# Altium schematic sheet ThirdStageAmplifier.SchDoc
size A4; Author: Michał Kowalik; CompanyName: AGH; Engineer: dr inż. Piotr Otfinowski; DocumentNumber: 4; Revision: Rev; SheetNumber: 4; SheetTotal: 6; ProjectName: Project Name
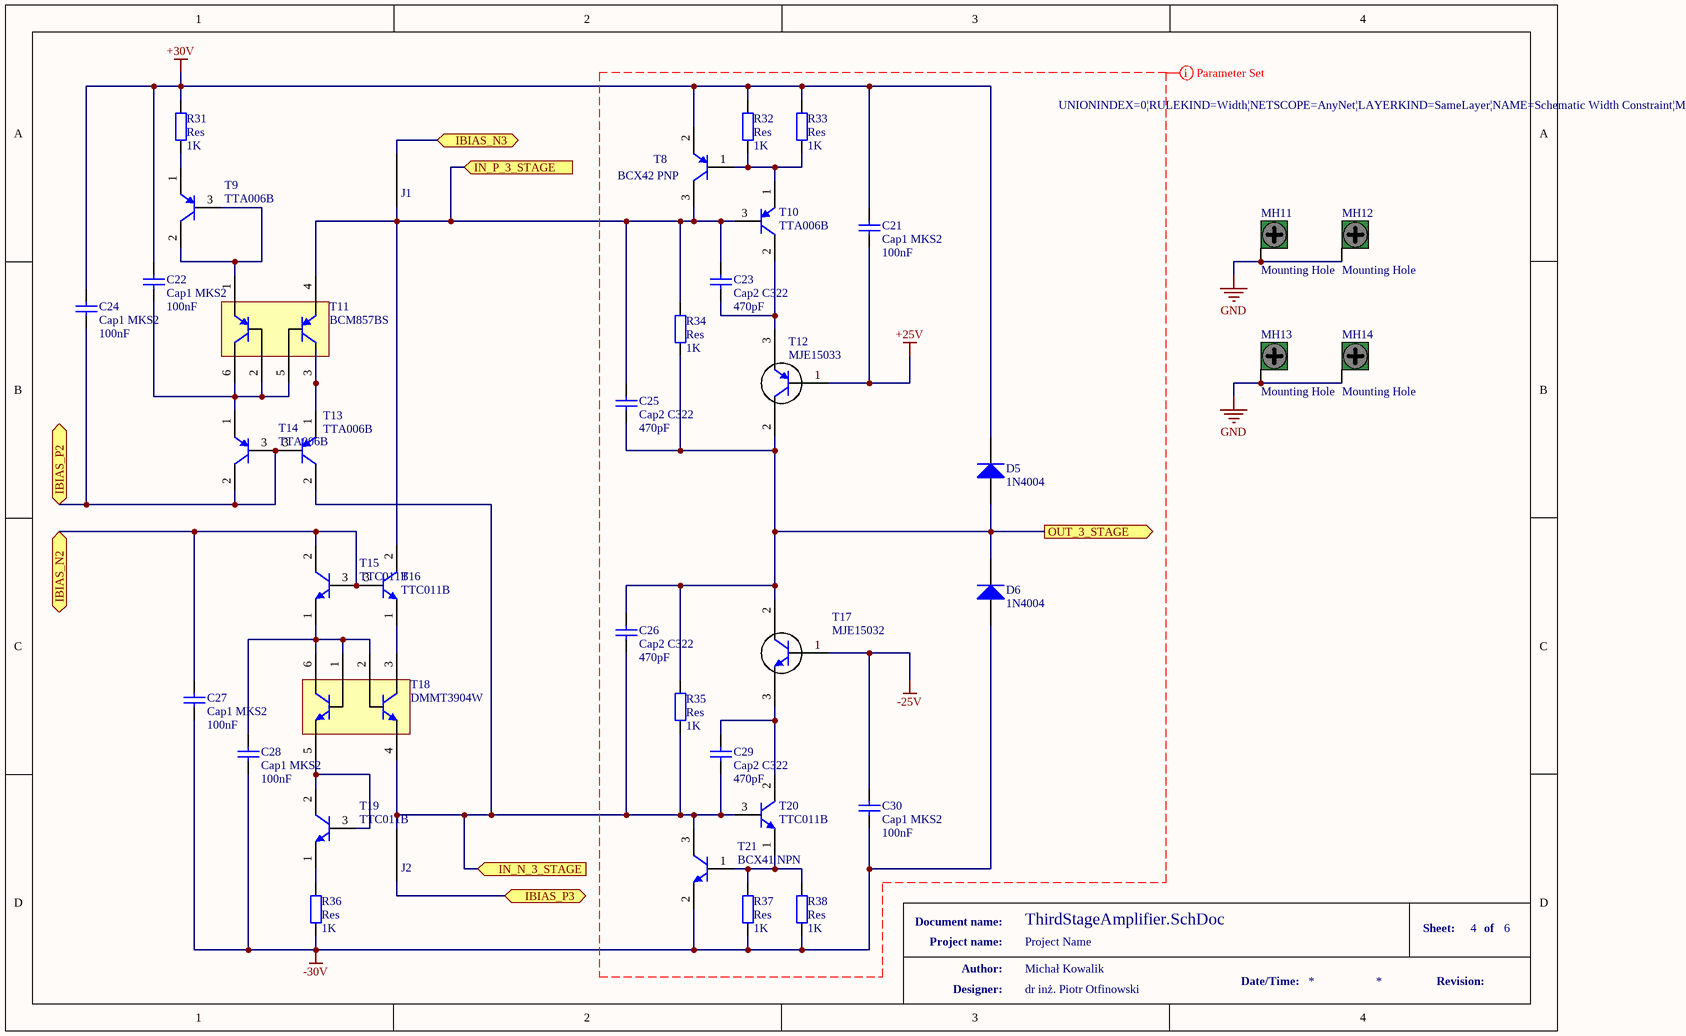
[diagram p0: ThirdStageAmplifier.SchDoc]

## Parts
C21  Cap1 MKS2  value 100nF  [CAP-0.5-WIMA_MKS2]
C22  Cap1 MKS2  value 100nF  [CAP-0.5-WIMA_MKS2]
C23  Cap2 C322  value 470pF  [CAP-CERAMIC-200MIL]
C24  Cap1 MKS2  value 100nF  [CAP-0.5-WIMA_MKS2]
C25  Cap2 C322  value 470pF  [CAP-CERAMIC-200MIL]
C26  Cap2 C322  value 470pF  [CAP-CERAMIC-200MIL]
C27  Cap1 MKS2  value 100nF  [CAP-0.5-WIMA_MKS2]
C28  Cap1 MKS2  value 100nF  [CAP-0.5-WIMA_MKS2]
C29  Cap2 C322  value 470pF  [CAP-CERAMIC-200MIL]
C30  Cap1 MKS2  value 100nF  [CAP-0.5-WIMA_MKS2]
D5  1N4004  [DO-41]
D6  1N4004  [DO-41]
J1  NetTie  [NETTIE_20mil]  (value not drawn)  (net tie, no BOM)
J2  NetTie  [NETTIE_20mil]  (value not drawn)  (net tie, no BOM)
MH11  Mounting Hole  [MOUNTING HOLE 3mm]  (no BOM)
MH12  Mounting Hole  [MOUNTING HOLE 3mm]  (no BOM)
MH13  Mounting Hole  [MOUNTING HOLE 3mm]  (no BOM)
MH14  Mounting Hole  [MOUNTING HOLE 3mm]  (no BOM)
R31  Res  value 1K  [RESISTOR-10mm]
R32  Res  value 1K  [RESISTOR-10mm]
R33  Res  value 1K  [RESISTOR-10mm]
R34  Res  value 1K  [RESISTOR-10mm]
R35  Res  value 1K  [RESISTOR-10mm]
R36  Res  value 1K  [RESISTOR-10mm]
R37  Res  value 1K  [RESISTOR-10mm]
R38  Res  value 1K  [RESISTOR-10mm]
T8  BCX42 PNP  [SOT23_IPC_MD]
T9  TTA006B  [TO-126]
T10  TTA006B  [TO-126]
T11  BCM857BS  [SOT363_IPC_MD]
T12  MJE15033  [TO-220]
T13  TTA006B  [TO-126]
T14  TTA006B  [TO-126]
T15  TTC011B  [TO-126]
T16  TTC011B  [TO-126]
T17  MJE15032  [TO-220]
T18  DMMT3904W  [SOT363_IPC_MD]
T19  TTC011B  [TO-126]
T20  TTC011B  [TO-126]
T21  BCX41 NPN  [SOT23_IPC_MD]

## Ports
IBIAS_N2 (bidir), IBIAS_N3 (bidir), IBIAS_P2 (bidir), IBIAS_P3 (bidir), IN_N_3_STAGE (in), IN_P_3_STAGE (in), OUT_3_STAGE (out)

## Nets
+25V: C21.1 T12.1(B)
+30V: C21.2 C22.2 C24.2 D5.2(IN2) R31.2 R32.2 R33.2 T8.2(E)
-25V: C30.2 T17.1(B)
-30V: C27.1 C28.1 C30.1 D6.1(IN1) R36.1 R37.1 R38.1 T21.2(E)
GND: MH11.MOUNTING MH12.MOUNTING MH13.MOUNTING MH14.MOUNTING
IBIAS_N2: C27.2 T15.2(C) T15.3(B) T16.3(B) ; port IBIAS_N2
IBIAS_N3: J1.1 ; port IBIAS_N3
IBIAS_P2: C24.1 T13.3(B) T14.2(C) T14.3(B) ; port IBIAS_P2
IBIAS_P3: J2.1 ; port IBIAS_P3
IN_N_3_STAGE: C26.1 C29.1 J2.2 R35.1 T13.2(C) T18.4(E2) T20.3(B) T21.3(C) ; port IN_N_3_STAGE
IN_P_3_STAGE: C23.2 C25.2 J1.2 R34.2 T8.3(C) T10.3(B) T11.4(C2) T16.2(C) ; port IN_P_3_STAGE
OUT_3_STAGE: C25.1 C26.2 D5.1(IN1) D6.2(IN2) R34.1 R35.2 T12.2(C) T17.2(C) ; port OUT_3_STAGE
NetC22_1: C22.1 T11.2(B1) T11.5(B2) T11.6(E1) T14.1(E)
NetC23_1: C23.1 T10.2(C) T12.3(E)
NetC28_2: C28.2 T15.1(E) T18.1(B1) T18.2(B2) T18.6(C1)
NetC29_2: C29.2 T17.3(E) T20.2(C)
NetR31_1: R31.1 T9.1(E)
NetR32_1: R32.1 R33.1 T8.1(B) T10.1(E)
NetR36_2: R36.2 T19.1(E)
NetR37_2: R37.2 R38.2 T20.1(E) T21.1(B)
NetT9_2: T9.2(C) T9.3(B) T11.1(C1)
NetT11_3: T11.3(E2) T13.1(E)
NetT16_1: T16.1(E) T18.3(C2)
NetT18_5: T18.5(E1) T19.2(C) T19.3(B)

## Layout directives
rule Width Constraint [Pref Width = 15mil    Min Width = 12mil    Max Width = 20mil]: +25V, -25V

## Notes on the sheet
- Document name:
- Project name:
- Author:
- Date/Time:
- Sheet:
- Revision:
- of
- Designer:

## Library data of the parts
C21 C22 C24 C27 C28 C30 = Cap1: WIMA MKS2 Metallized Polyester (PET) / Capacitors in PCM 5 mm
C23 C25 C26 C29 = Cap2: KEMEX Radial Leaded Multilayer Ceramic Capacitors / Goldmax, 300 Series, Conformally Coated, / C0G Dielectric, 25 – 250 VDC (Commercial Grade)
D5 D6 = 1N4004: Standard Recovery Rectifier Diodes
R31-R38 = Res: Resistor
T8 = BCX42: PNP Silicon AF and Switching Transistor; ComponentLink1Description: Manufacturer Link; ComponentLink1URL: http://www.fairchildsemi.com/; ComponentLink2Description: Datasheet; ComponentLink2URL: http://www.fairchildsemi.com/ds/2N%2F2N3906.pdf
T9 T10 T13 T14 = TTA006B: PNP High Voltage Transistor; ComponentLink1Description: Manufacturer Link; ComponentLink1URL: http://www.fairchildsemi.com/; ComponentLink2Description: Datasheet; ComponentLink2URL: http://www.fairchildsemi.com/ds/2N%2F2N3906.pdf
T11 = BCM857BS: 40V MATCHED PAIR NPN SMALL SIGNAL TRANSISTOR
T12 = MJE15033: PNP High Power Transistor; ComponentLink1Description: Manufacturer Link; ComponentLink1URL: http://www.fairchildsemi.com/; ComponentLink2Description: Datasheet; ComponentLink2URL: http://www.fairchildsemi.com/ds/2N%2F2N3904.pdf
T15 T16 T19 T20 = TTC011B: NPN High Voltage Transistor; ComponentLink1Description: Manufacturer Link; ComponentLink1URL: http://www.fairchildsemi.com/; ComponentLink2Description: Datasheet; ComponentLink2URL: http://www.fairchildsemi.com/ds/2N%2F2N3904.pdf
T17 = MJE15032: NPN High Power Transistor; ComponentLink1Description: Manufacturer Link; ComponentLink1URL: http://www.fairchildsemi.com/; ComponentLink2Description: Datasheet; ComponentLink2URL: http://www.fairchildsemi.com/ds/2N%2F2N3904.pdf
T18 = DMMT3904W: 40V MATCHED PAIR NPN SMALL SIGNAL TRANSISTOR
T21 = BCX41: NPN Silicon AF and Switching Transistor; ComponentLink1Description: Manufacturer Link; ComponentLink1URL: http://www.fairchildsemi.com/; ComponentLink2Description: Datasheet; ComponentLink2URL: http://www.fairchildsemi.com/ds/2N%2F2N3904.pdf